# EAGLE design rfid_tag (EAGLE 5.04)
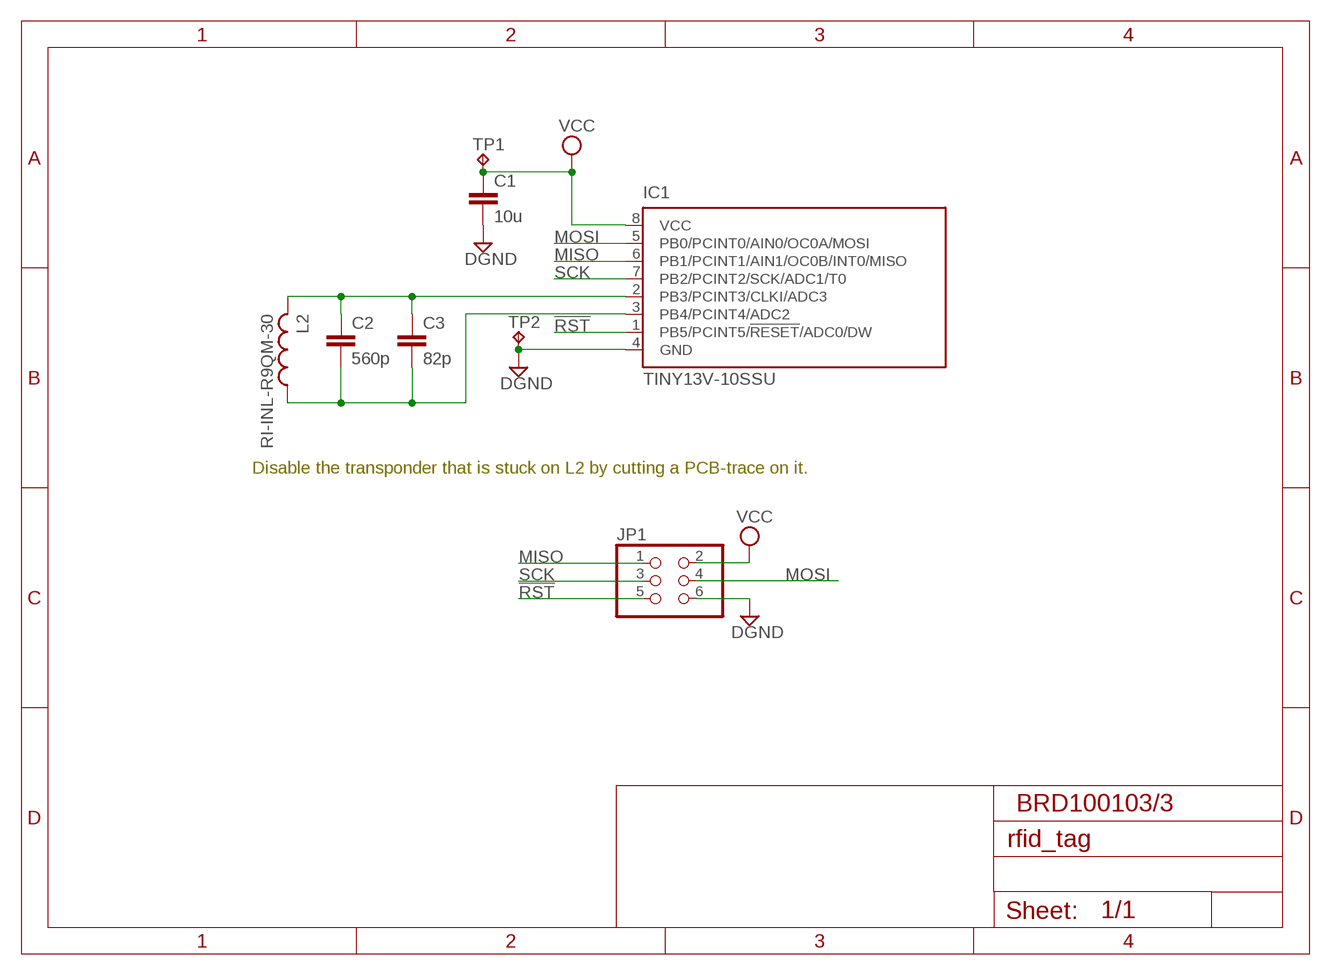
[diagram p0: schematic, sheet 1]

## Parts
C1  10u  C-EUC1206  [C1206]
C2  560p  C-EUC0805  [C0805]
C3  82p  C-EUC0805  [C0805]
IC1  TINY13V-10SSU  [8S1]
JP1  PINHD-2X3  [2X03]
L2  RI-INL-R9QM-30  L-US0204/7  [0204/7]
TP1  TPB2,54  [B2,54]
TP2  TPB2,54  [B2,54]

## Nets
!RST: IC1.1(PB5/PCINT5/!RESET!/ADC0/DW) JP1.5
DGND: C1.2 IC1.4(GND) JP1.6 TP2.PP(TP)
MISO: IC1.6(PB1/PCINT1/AIN1/OC0B/INT0/MISO) JP1.1
MOSI: IC1.5(PB0/PCINT0/AIN0/OC0A/MOSI) JP1.4
N$1: C2.1 C3.1 IC1.2(PB3/PCINT3/CLKI/ADC3) L2.2
N$2: C2.2 C3.2 IC1.3(PB4/PCINT4/ADC2) L2.1
SCK: IC1.7(PB2/PCINT2/SCK/ADC1/T0) JP1.3
VCC: C1.1 IC1.8(VCC) JP1.2 TP1.PP(TP)

## Notes on the sheet
- Disable the transponder that is stuck on L2 by cutting a PCB-trace on it.
- BRD100103/3

## Library data of the parts
C1-C3 = rcl:C-EU: CAPACITOR, European symbol
IC1 = atmel:TINY13: 8-bit AVR Microcontroller with 1K Bytes In-System Programmable Flash Source: http://www.atmel.com/dyn/resources/prod_documents/2535S.pdf
JP1 = rfid:PINHD-2X3: PIN HEADER
L2 = rcl:L-US: INDUCTOR, American symbol
TP1 TP2 = testpad:TP: Test pad

## Board
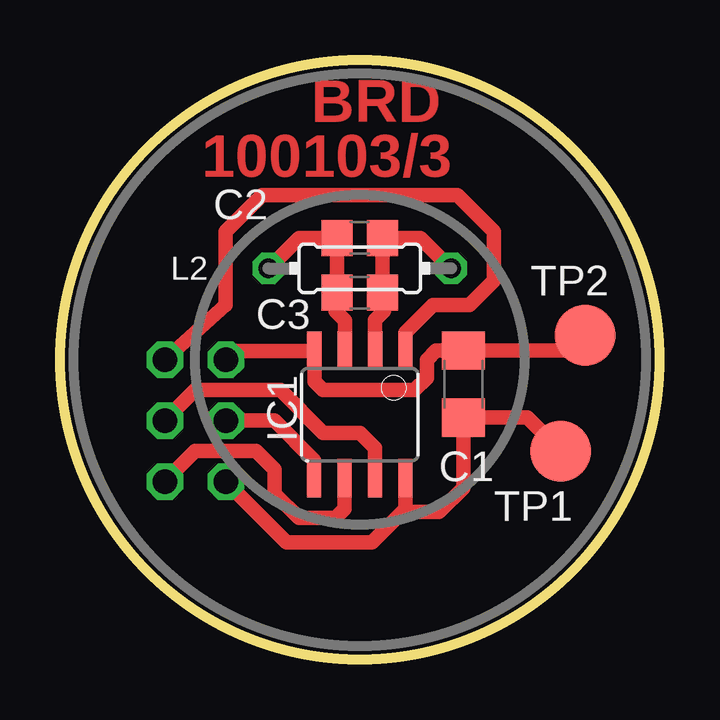
[diagram p1: board, top side]
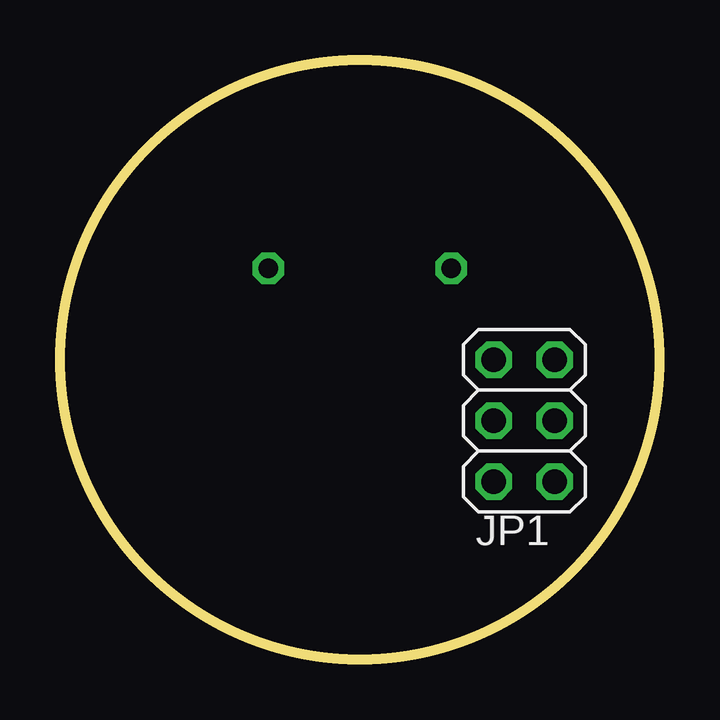
[diagram p2: board, bottom side, seen from below]

Size 25 x 25 mm. Coordinates in mm from the lower left corner, seen from the top.
Outline: circle at 12.5,12.5 radius 12.5
Copper layers (1*16): Top 0.035mm / dielectric 1.5mm / Bottom 0.035mm
Design rules "default *": minimum track width 10mil, minimum drill 24mil, track to track 8mil, track to pad 8mil, pad to pad 8mil, via to via 8mil, smd to smd 8mil, copper to edge 40mil, drill to drill 8mil, minimum pad ring 10mil, minimum via ring 8mil, stop-mask expansion 4mil, vias tented up to drill 0mil, thermal gap 10mil

### Footprints (pad centres in the part's own frame; a part is rotated, then mirrored left to right if it is on the bottom)
C1206 = smd 1.6 x 1.8: 1 -1.4,0; 2 1.4,0
C0805 = smd 1.3 x 1.5: 1 -0.95,0; 2 0.95,0
8S1 = smd 0.6 x 1.6: 1 -1.905,-2.654; 2 -0.645,-2.654; 3 0.625,-2.654; 4 1.895,-2.654; 5 1.905,2.654; 6 0.635,2.654; 7 -0.635,2.654; 8 -1.905,2.654
2X03 = drill 1.016 octagon: 1 -2.54,-1.27; 2 -2.54,1.27; 3 0,-1.27; 4 0,1.27; 5 2.54,-1.27; 6 2.54,1.27
0204/7 = drill 0.813 octagon: 1 -3.81,0; 2 3.81,0
B2,54 = smd 2.54 x 2.54: PP 0,0

### Placement (x,y rotation side)
C1  16.82,11.48 90 top
C2  12.5,17.58 180 top
C3  12.5,15.29 180 top
IC1  12.5,10.21 180 top
JP1  5.64,9.96 90 bottom
L2  12.5,16.31 0 top
TP1  20.88,8.69 0 top
TP2  21.9,13.52 0 top
U$1  [DINA5_L]  -80.97,-66.49 0 top  (outside the outline)

### Tracks (layer width: path | path; a pad name or v marks a point on that pad's centre or on a via)
!RST
  Top 0.61: JP1.5 6.91,14.79 6.91,17.83 8.44,19.36 16.56,19.36 18.09,17.83 18.09,15.8 17.07,14.79 15.55,14.79 14.41,13.64 IC1.1
DGND
  Top 0.61: C1.2 16.31,13.26 | C1.2 15.68,12.88 15.29,12.5 15.29,11.74 14.79,11.23 10.98,11.23 10.61,11.6 IC1.4 7.28,12.87 JP1.6 | C1.2 21.27,12.88 TP2.PP
MISO
  Top 0.61: IC1.6 11.87,6.28 11.48,5.9 9.96,5.9 8.94,6.91 8.94,7.93 8.18,8.69 5.64,8.69 JP1.1
MOSI
  Top 0.61: IC1.5 10.6,8.31 8.94,9.96 JP1.4
N$1
  Top 0.61: L2.2 15.04,17.58 C2.1 C3.1 13.52,15.23 13.52,14.53 13.15,14.16 IC1.2
N$2
  Top 0.61: IC1.3 11.88,14.14 11.48,14.53 11.48,15.23 C3.2 C2.2 9.96,17.58 L2.1
SCK
  Top 0.61: IC1.7 13.14,8.82 12.5,9.45 10.98,9.45 9.2,11.23 5.64,11.23 JP1.3
VCC
  Top 0.61: 14.28,6.15 15.8,6.15 16.82,7.17 C1.1 19.49,10.08 TP1.PP | 14.28,6.15 13.01,4.88 9.45,4.88 JP1.2 | IC1.8 14.41,6.15 14.28,6.15

### Text on the board
Top: BRD | 100103/3
tDocu: BRD100103/3 | 3
bDocu: BRD100103/3 | 3